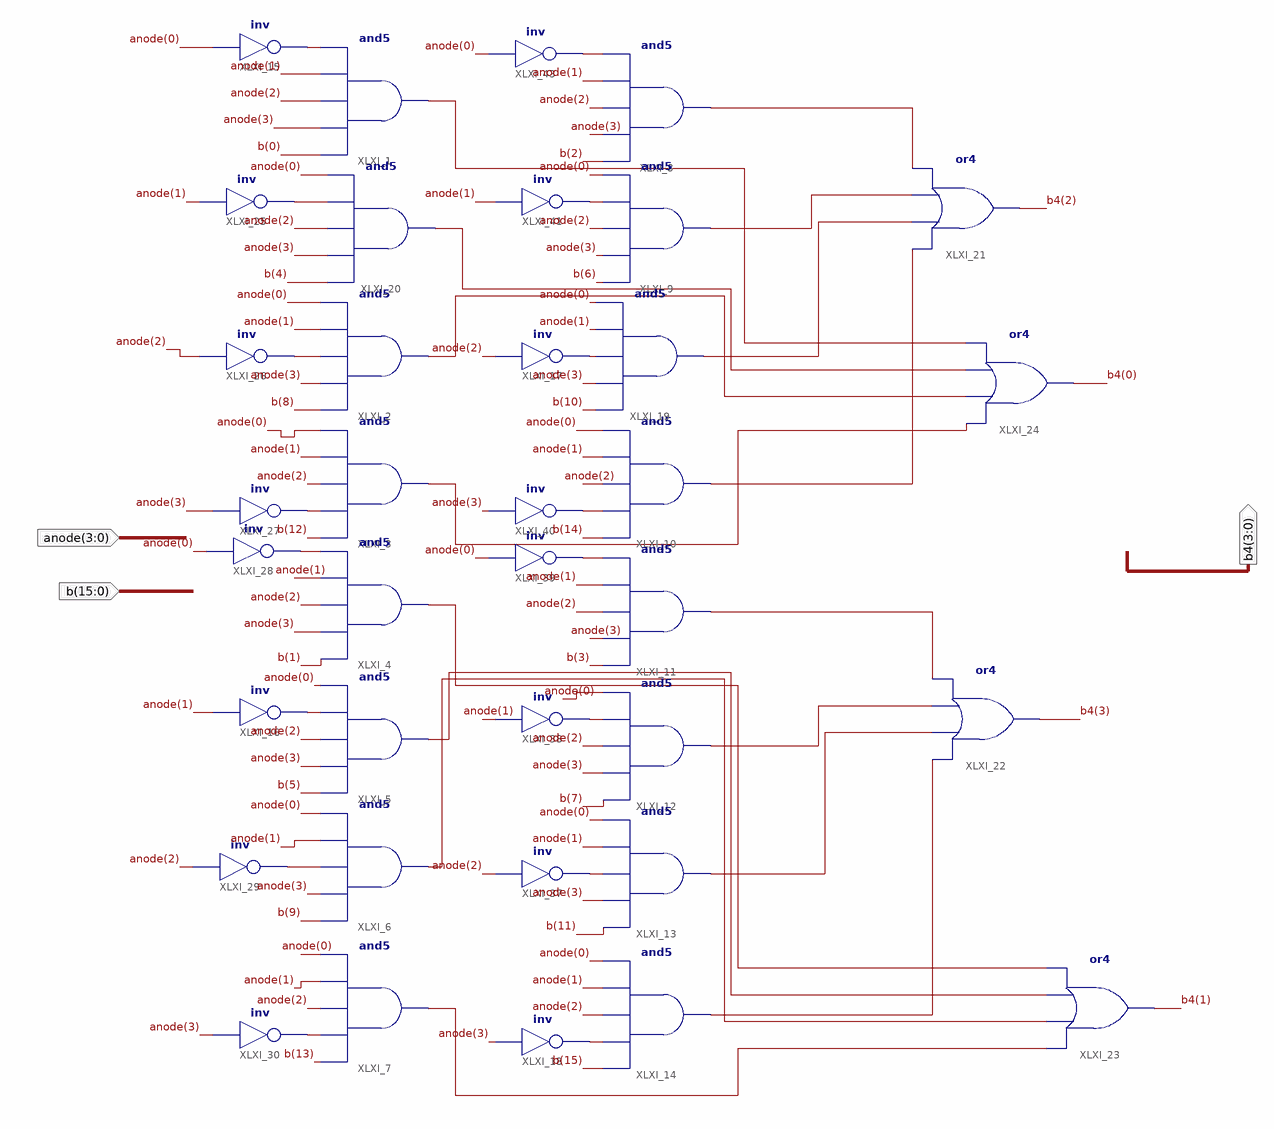
[diagram p0: schematic sheet 1]
// Xilinx ISE schematic mux16_4.sch (artix7) as structural Verilog: 36 symbols, 3 ports
module mux16_4 (
  input  [15:0] b,
  input  [3:0] anode,
  output [3:0] b4
);

  wire XLXN_2, XLXN_3, XLXN_4, XLXN_5, XLXN_12, XLXN_18, XLXN_25, XLXN_27, XLXN_40, XLXN_47, XLXN_49,
       XLXN_55, XLXN_67, XLXN_69, XLXN_75, XLXN_81, XLXN_89, XLXN_90, XLXN_91, XLXN_92, XLXN_93, XLXN_94,
       XLXN_95, XLXN_96, XLXN_97, XLXN_98, XLXN_99, XLXN_102, XLXN_103, XLXN_104, XLXN_109, XLXN_110;

  and XLXI_1 (XLXN_97, b[0], anode[3], anode[2], anode[1], XLXN_2);
  and XLXI_2 (XLXN_99, b[8], anode[3], XLXN_18, anode[1], anode[0]);
  and XLXI_3 (XLXN_109, b[12], XLXN_25, anode[2], anode[1], anode[0]);
  and XLXI_4 (XLXN_110, b[1], anode[3], anode[2], anode[1], XLXN_27);
  and XLXI_5 (XLXN_102, b[5], anode[3], anode[2], XLXN_3, anode[0]);
  and XLXI_6 (XLXN_103, b[9], anode[3], XLXN_40, anode[1], anode[0]);
  and XLXI_7 (XLXN_104, b[13], XLXN_47, anode[2], anode[1], anode[0]);
  and XLXI_8 (XLXN_89, b[2], anode[3], anode[2], anode[1], XLXN_49);
  and XLXI_9 (XLXN_90, b[6], anode[3], anode[2], XLXN_55, anode[0]);
  and XLXI_10 (XLXN_92, b[14], XLXN_67, anode[2], anode[1], anode[0]);
  and XLXI_11 (XLXN_93, b[3], anode[3], anode[2], anode[1], XLXN_69);
  and XLXI_12 (XLXN_94, b[7], anode[3], anode[2], XLXN_75, anode[0]);
  and XLXI_13 (XLXN_95, b[11], anode[3], XLXN_81, anode[1], anode[0]);
  and XLXI_14 (XLXN_96, b[15], XLXN_5, anode[2], anode[1], anode[0]);
  not XLXI_15 (XLXN_2, anode[0]);
  not XLXI_18 (XLXN_5, anode[3]);
  and XLXI_19 (XLXN_91, b[10], anode[3], XLXN_4, anode[1], anode[0]);
  and XLXI_20 (XLXN_98, b[4], anode[3], anode[2], XLXN_12, anode[0]);
  or XLXI_21 (b4[2], XLXN_92, XLXN_91, XLXN_90, XLXN_89);
  or XLXI_22 (b4[3], XLXN_96, XLXN_95, XLXN_94, XLXN_93);
  or XLXI_23 (b4[1], XLXN_104, XLXN_103, XLXN_102, XLXN_110);
  or XLXI_24 (b4[0], XLXN_109, XLXN_99, XLXN_98, XLXN_97);
  not XLXI_26 (XLXN_18, anode[2]);
  not XLXI_27 (XLXN_25, anode[3]);
  not XLXI_28 (XLXN_27, anode[0]);
  not XLXI_30 (XLXN_47, anode[3]);
  not XLXI_37 (XLXN_81, anode[2]);
  not XLXI_39 (XLXN_69, anode[0]);
  not XLXI_40 (XLXN_67, anode[3]);
  not XLXI_41 (XLXN_55, anode[1]);
  not XLXI_43 (XLXN_49, anode[0]);
  not XLXI_16 (XLXN_3, anode[1]);
  not XLXI_29 (XLXN_40, anode[2]);
  not XLXI_38 (XLXN_75, anode[1]);
  not XLXI_17 (XLXN_4, anode[2]);
  not XLXI_25 (XLXN_12, anode[1]);
endmodule
